# EAGLE design HB-UNI-SEN-CAP-MOIST (EAGLE 9.3.1)
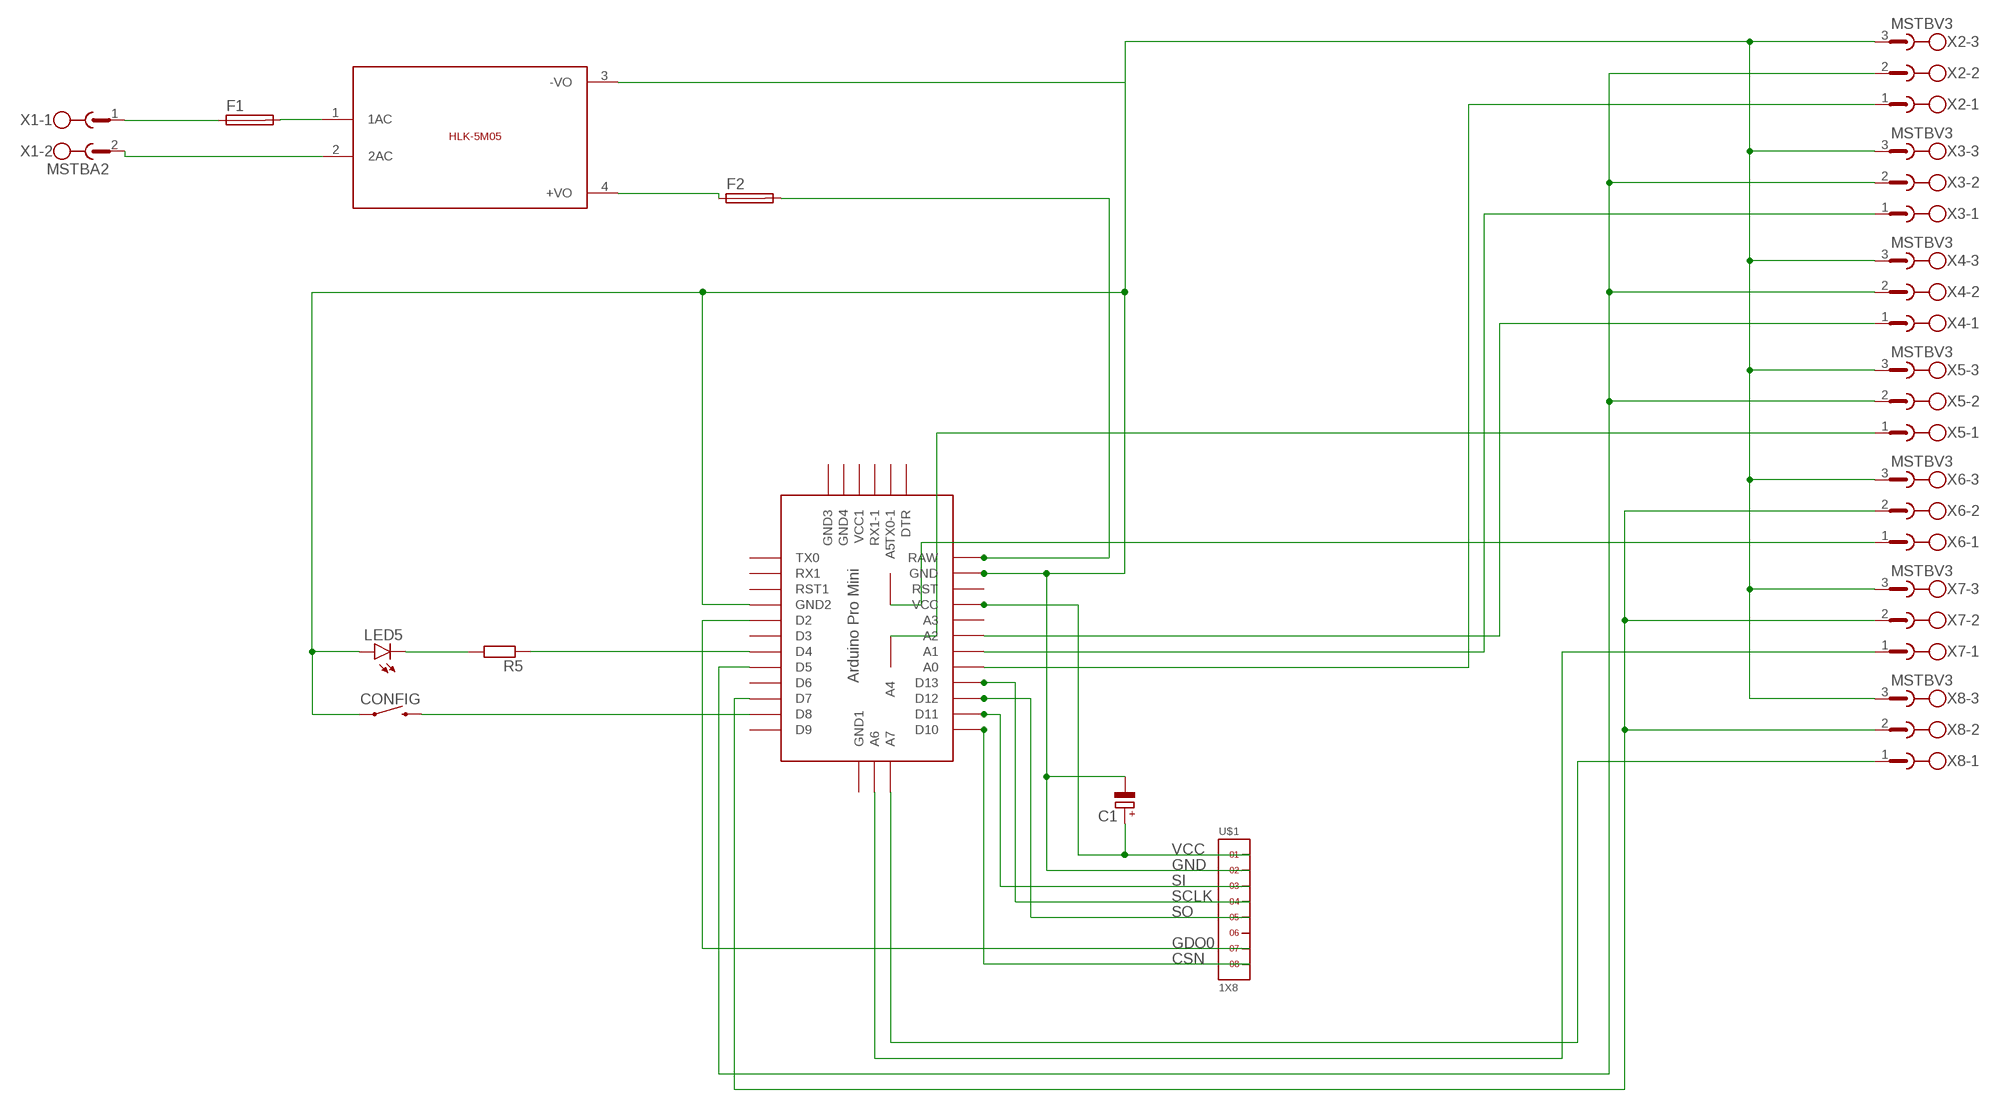
[diagram p0: schematic, sheet 1]

## Parts
C1  CPOL-EUE2.5-5  [E2,5-5]
CONFIG  MOMENTARY-SWITCH-SPST-PTH-6.0MM-KIT  [TACTILE_SWITCH_PTH_6.0MM_KIT]
F1  SH22,5A  [SH22,5A]
F2  SH22,5A  [SH22,5A]
LED5  LED3MM  [LED3MM]
R5  R-EU_0309/10  [0309/10]
U$1  1X8  [1X8]
U$2  ABK-PRO-MINI  [ABK-PRO-MINI]
U$3  5VDC/5W  HLK-5M05  [HLK-5M05]
X1  MSTBA2  [MSTBA2]
X2  MSTBV3  [MSTBV3]
X3  MSTBV3  [MSTBV3]
X4  MSTBV3  [MSTBV3]
X5  MSTBV3  [MSTBV3]
X6  MSTBV3  [MSTBV3]
X7  MSTBV3  [MSTBV3]
X8  MSTBV3  [MSTBV3]

## Nets
CSN: U$1.8 U$2.D10
GDO0: U$1.7 U$2.D2
GND: C1.- CONFIG.1 LED5.A U$1.2 U$2.GND U$2.GND1(GND2) U$3.3(-VO) X2.3 X3.3 X4.3 X5.3 X6.3 X7.3 X8.3
N$1: U$2.A0 X2.1
N$2: U$2.A1 X3.1
N$3: U$2.A2 X4.1
N$4: U$2.A4 X5.1
N$5: U$2.A5 X6.1
N$6: U$2.A6 X7.1
N$7: U$2.A7 X8.1
N$8: U$2.D5 X2.2 X3.2 X4.2 X5.2
N$9: F1.1 X1.1
N$10: F2.1 U$3.4(+VO)
N$11: U$3.2(2AC) X1.2
N$12: U$2.D7 X6.2 X7.2 X8.2
N$16: CONFIG.3 U$2.D8
N$17: R5.1 U$2.D4
N$18: LED5.K(C) R5.2
N$19: F1.2 U$3.1(1AC)
N$24: F2.2 U$2.RAW
SCLK: U$1.4 U$2.D13
SI: U$1.3 U$2.D11
SO: U$1.5 U$2.D12
VCC: C1.+ U$1.1 U$2.VCC
Unconnected: U$1.6 U$2.A3 U$2.D3 U$2.D6 U$2.D9 U$2.DTR U$2.GND2(GND3) U$2.GND3(GND4) U$2.GND4(GND1) U$2.RST U$2.RST1 U$2.RX1 U$2.RX1-1 U$2.TX0 U$2.TX0-1 U$2.VCC1

## Library data of the parts
C1 = resistor:CPOL-EU: POLARIZED CAPACITOR, European symbol
CONFIG = SparkFun-Switches:MOMENTARY-SWITCH-SPST: Momentary Switch (Pushbutton) - SPST Normally-open (NO) SPST momentary switches (buttons, pushbuttons). Variants PTH-12MM - 12mm square, through-hole Momentary Pushbutton Switch - 12mm Square <https://www.sparkfun.com/products/9190> (COM-09190) PTH-6.0MM, PTH-6.0MM-KIT - 6.0mm square, through-hole Mini Pushbutton Switch <https://www.sparkfun.com/products/97> (COM-00097) KIT package intended for soldering kit's - only one side of pads' copper is exposed. PTH-RIGHT-ANGLE-KIT - Right-angle, through-hole Right Angle Tactile Button <https://www.sparkfun.com/products/10791> - Used on SparkFun BigTime Watch Kit <https://www.sparkfun.com/products/11734> SMD-12MM - 12mm square, surface-mount Tactile Button - SMD (12mm) <https://www.sparkfun.com/products/12993> (COM-12993) Used on SparkFun PicoBoard <https://www.sparkfun.com/products/11888> SMD-4.5MM - 4.5mm Square Trackball Switch Used on SparkFun Blackberry Trackballer Breakout <https://www.sparkfun.com/products/13169> SMD-4.6MMX2.8MM - 4.60mm x 2.80mm, surface mount Used on SparkFun SAMD21 Mini Breakout <https://www.sparkfun.com/products/13664> SMD-5.2MM, SMD-5.2-REDUNDANT - 5.2mm square, surface-mount Mini Pushbutton Switch - SMD <https://www.sparkfun.com/products/8720> (COM-08720) Used on Arduino Pro Mini <https://www.sparkfun.com/products/11114> REDUNDANT package connects both switch circuits together SMD-6.0X3.5MM - 6.0 x 3.5mm, surface mount Momentary Reset Switch SMD <https://www.sparkfun.com/products/8229> (COM-08229) SMD-6.2MM-TALL - 6.2mm square, surface mount Tactile Button - SMD (6mm) <https://www.sparkfun.com/products/12992> Used on SparkFun Digital Sandbox <https://www.sparkfun.com/products/12651> SMD-RIGHT-ANGLE - Right-angle, surface mount Used on SparkFun Block for Intel® Edison - Arduino <https://www.sparkfun.com/products/13036>; PROD_ID: SWCH-08441; SF_SKU: COM-00097
F1 F2 = fuse:SH22,5A: FUSE HOLDER grid 22,5mm, isolated cap OGN0031 8201, Schurter (Buerklin); MPN: 0031.7701.11; OC_FARNELL: unknown; OC_NEWARK: 04F1224
LED5 = led:LED: LED OSRAM: - CHIPLED LG R971, LG N971, LY N971, LG Q971, LY Q971, LO R971, LY R971 LH N974, LH R974 LS Q976, LO Q976, LY Q976 LO Q996 - Hyper CHIPLED LW Q18S LB Q993, LB Q99A, LB R99A - SideLED LS A670, LO A670, LY A670, LG A670, LP A670 LB A673, LV A673, LT A673, LW A673 LH A674 LY A675 LS A676, LA A676, LO A676, LY A676, LW A676 LS A679, LY A679, LG A679 - Hyper Micro SIDELED® LS Y876, LA Y876, LO Y876, LY Y876 LT Y87S - SmartLED LW L88C, LW L88S LB L89C, LB L89S, LG L890 LS L89K, LO L89K, LY L89K LS L896, LA L896, LO L896, LY L896 - TOPLED LS T670, LO T670, LY T670, LG T670, LP T670 LSG T670, LSP T670, LSY T670, LOP T670, LYG T670 LG T671, LOG T671, LSG T671 LB T673, LV T673, LT T673, LW T673 LH T674 LS T676, LA T676, LO T676, LY T676, LB T676, LH T676, LSB T676, LW T676 LB T67C, LV T67C, LT T67C, LS T67K, LO T67K, LY T67K, LW E67C LS E67B, LA E67B, LO E67B, LY E67B, LB E67C, LV E67C, LT E67C LW T67C LS T679, LY T679, LG T679 LS T770, LO T770, LY T770, LG T770, LP T770 LB T773, LV T773, LT T773, LW T773 LH T774 LS E675, LA E675, LY E675, LS T675 LS T776, LA T776, LO T776, LY T776, LB T776 LHGB T686 LT T68C, LB T68C - Hyper Mini TOPLED® LB M676 - Mini TOPLED Santana® LG M470 LS M47K, LO M47K, LY M47K Source: http://www.osram.convergy.de LUXEON: - LUMILED® LXK2-PW12-R00, LXK2-PW12-S00, LXK2-PW14-U00, LXK2-PW14-V00 LXK2-PM12-R00, LXK2-PM12-S00, LXK2-PM14-U00 LXK2-PE12-Q00, LXK2-PE12-R00, LXK2-PE12-S00, LXK2-PE14-T00, LXK2-PE14-U00 LXK2-PB12-K00, LXK2-PB12-L00, LXK2-PB12-M00, LXK2-PB14-N00, LXK2-PB14-P00, LXK2-PB14-Q00 LXK2-PR12-L00, LXK2-PR12-M00, LXK2-PR14-Q00, LXK2-PR14-R00 LXK2-PD12-Q00, LXK2-PD12-R00, LXK2-PD12-S00 LXK2-PH12-R00, LXK2-PH12-S00 LXK2-PL12-P00, LXK2-PL12-Q00, LXK2-PL12-R00 Source: www.luxeon.com KINGBRIGHT: KA-3528ASYC Source: www.kingbright.com
R5 = resistor:R-EU_: RESISTOR, European symbol
U$1 = headers(2mm):1X8
U$2 = Arduino-clone:ABK-PRO-MINI: ABK Pro-Mini Arduino Clone
U$3 = HLK-5M05:HLK-5M05: HLK-5M05 is an 5Volt/5W smps developed by HI-LINK; SIZE: 23x38(mm)
X1 = con-phoenix-508:MSTBA2: PHOENIX; MF: FARNELL; MPN: 1757242; OC_FARNELL: 3705171; OC_NEWARK: 71C4161
X2-X8 = con-phoenix-508:MSTBV3: PHOENIX; MPN: MSTBV 2,5/3-GF-5.08; OC_FARNELL: 1792793; OC_NEWARK: 69R9846

## Board
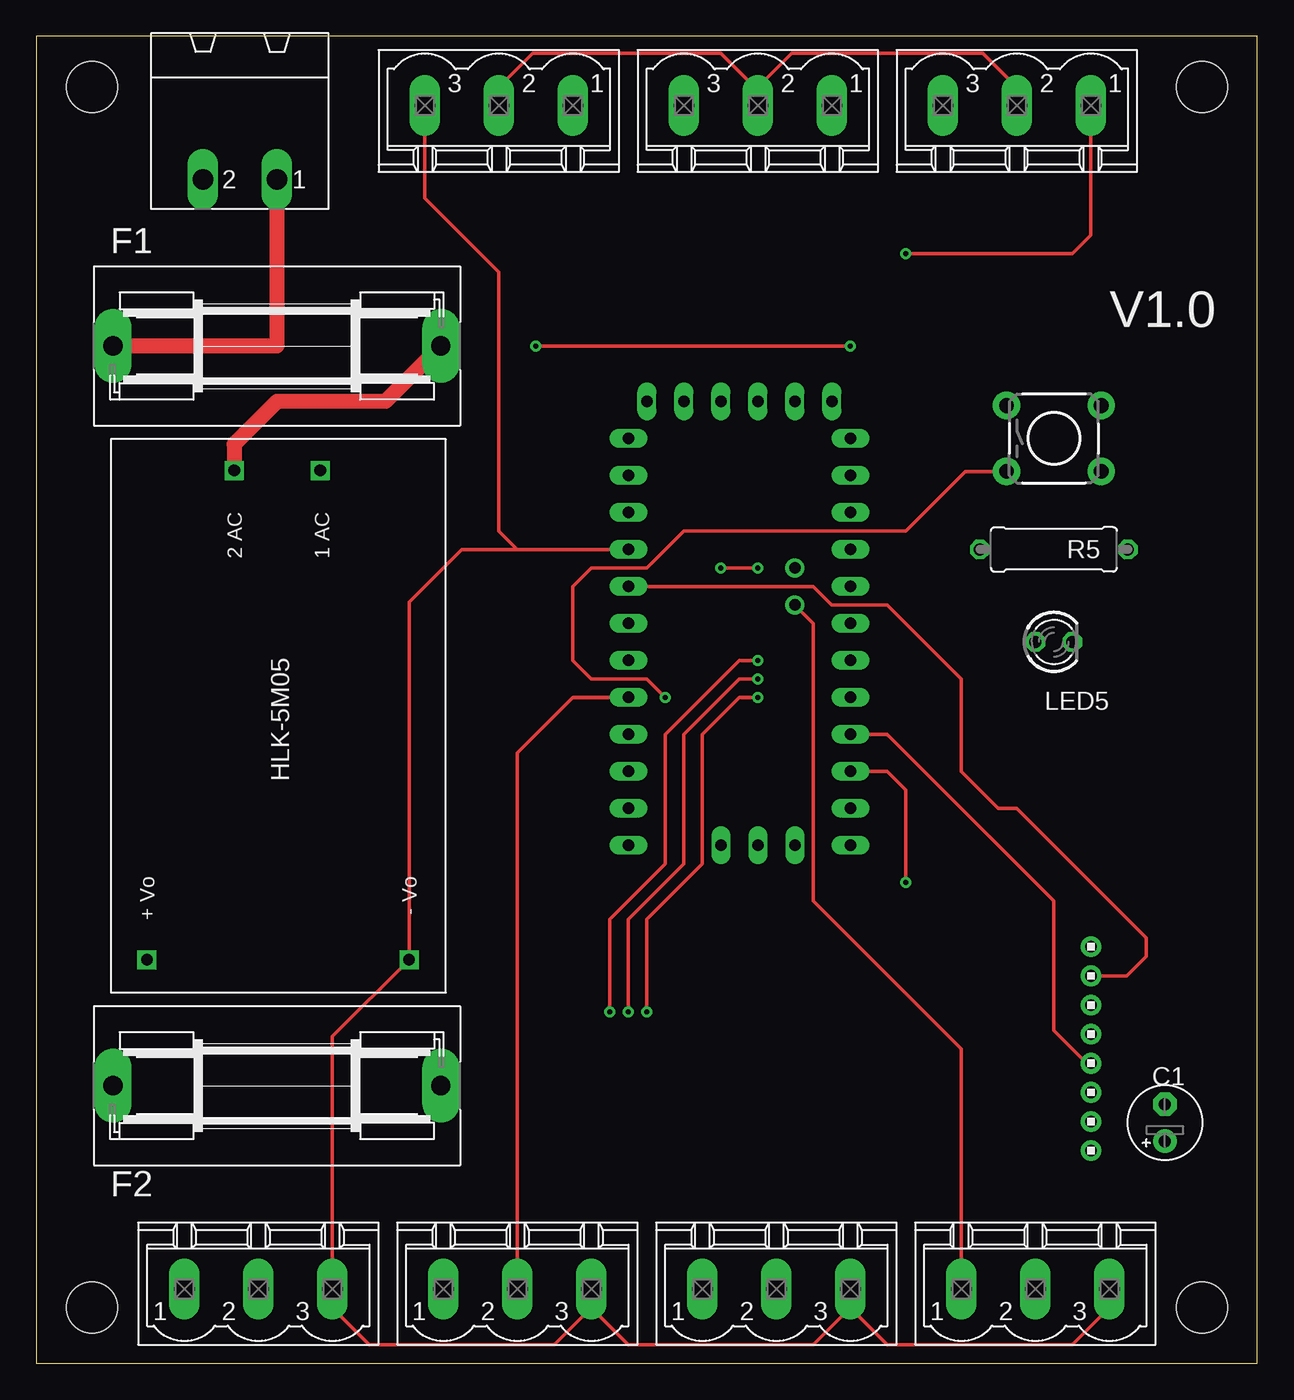
[diagram p1: board, top side]
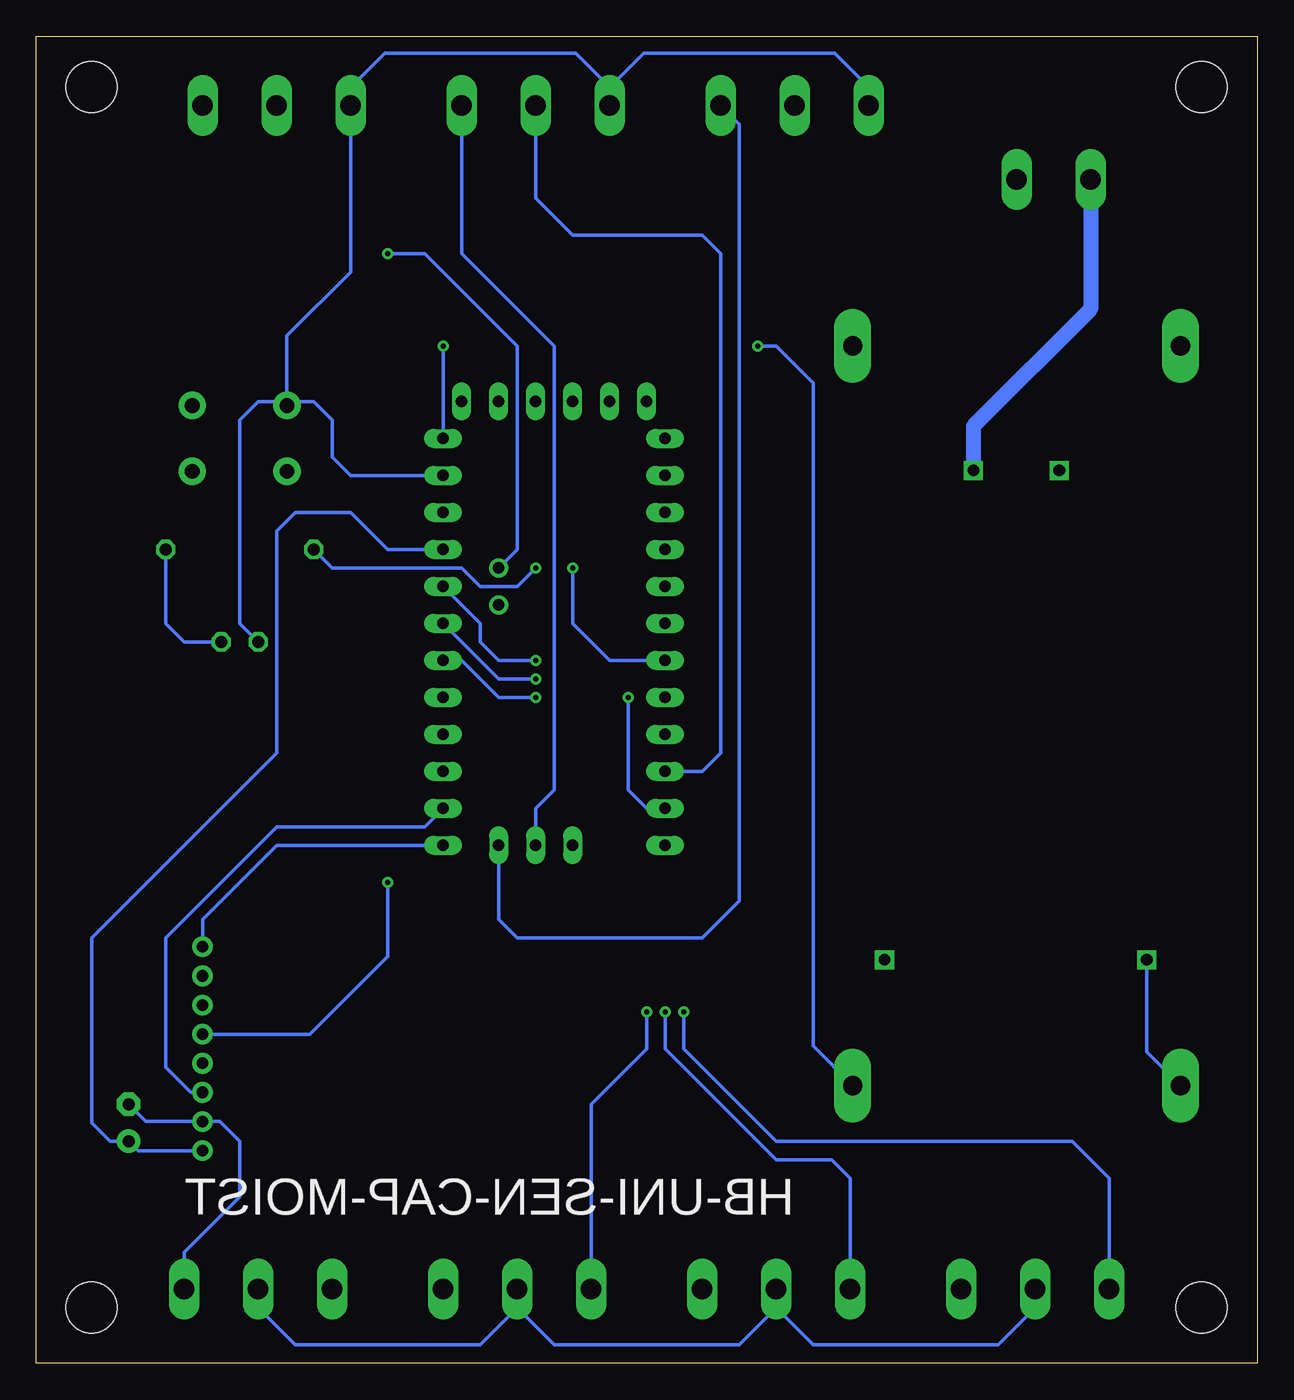
[diagram p2: board, bottom side, seen from below]

Size 83.8 x 91.11 mm. Coordinates in mm from the lower left corner, seen from the top.
Outline: 0,0 83.8,0 83.8,91.11 0,91.11 0,0
Copper layers (1*16): Top 0.035mm / dielectric 1.5mm / Bottom 0.035mm
Design rules "default": minimum track width 6mil, minimum drill 0.35mm, track to track 6mil, track to pad 6mil, pad to pad 6mil, via to via 6mil, smd to smd 6mil, copper to edge 40mil, drill to drill 6mil, minimum pad ring 10mil, minimum via ring 8mil, stop-mask expansion 4mil, vias tented up to drill 0mil, thermal gap 10mil
Holes 3.5 mm at 3.81,3.81 80.01,3.81 3.81,87.63 80.01,87.63

### Footprints (pad centres in the part's own frame; a part is rotated, then mirrored left to right if it is on the bottom)
E2,5-5 = drill 0.813 pad 1.6: + -1.27,0 | drill 0.813 pad 1.6 octagon: - 1.27,0
TACTILE_SWITCH_PTH_6.0MM_KIT = drill 1.016 pad 1.88: 1 -3.251,2.261; 2 3.251,2.261; 3 -3.251,-2.261; 4 3.251,-2.261
SH22,5A = drill 1.321 pad 2.54 long: 1 -11.252,0; 2 11.252,0
LED3MM = drill 0.813 octagon: A -1.27,0; K 1.27,0
0309/10 = drill 0.813 octagon: 1 -5.08,0; 2 5.08,0
1X8 = drill 0.8 pad 1.422: 1 -7,0; 2 -5,0; 3 -3,0; 4 -1,0; 5 1,0; 6 3,0; 7 5,0; 8 7,0
ABK-PRO-MINI = drill 0.8 long: A0 10.16,-3.81; A1 10.16,-6.35; A2 10.16,-8.89; A3 10.16,-11.43; A6 3.81,-21.59; A7 6.35,-21.59; D2 -5.08,-3.81; D3 -5.08,-6.35; D4 -5.08,-8.89; D5 -5.08,-11.43; D6 -5.08,-13.97; D7 -5.08,-16.51; D8 -5.08,-19.05; D9 -5.08,-21.59; D10 10.16,-21.59; D11 10.16,-19.05; D12 10.16,-16.51; D13 10.16,-13.97; DTR 8.89,8.89; GND 10.16,3.81; GND1 -5.08,-1.27; GND2 -3.81,8.89; GND3 -1.27,8.89; GND4 1.27,-21.59; RAW 10.16,6.35; RST 10.16,1.27; RST1 -5.08,1.27; RX1 -5.08,3.81; RX1-1 3.81,8.89; TX0 -5.08,6.35; TX0-1 6.35,8.89; VCC 10.16,-1.27; VCC1 1.27,8.89 | drill 0.8: A4 6.35,-5.08; A5 6.35,-2.54
HLK-5M05 = drill 0.8 square: 1 -16.85,-2.93; 2 -16.85,2.97; 3 16.75,9.07; 4 16.75,-8.93
MSTBA2 = drill 1.397 long: 1 -2.54,5.08; 2 2.54,5.08
MSTBV3 = drill 1.397 long: 1 -5.08,0; 2 0,0; 3 5.08,0

### Placement (x,y rotation side)
C1  77.47,16.51 90 top
CONFIG  69.85,63.5 0 top
F1  16.51,69.85 0 top
F2  16.51,19.05 0 top
LED5  69.85,49.53 0 top
R5  69.85,55.88 0 top
U$1  72.39,21.59 90 top
U$2  45.72,57.15 0 top
U$3  16.51,44.45 270 top
X1  13.97,86.36 180 top
X2  15.24,5.08 0 top
X3  33.02,5.08 0 top
X4  50.8,5.08 0 top
X5  68.58,5.08 0 top
X6  67.31,86.36 180 top
X7  49.53,86.36 180 top
X8  31.75,86.36 180 top

### Tracks (layer width: path | path; a pad name or v marks a point on that pad's centre or on a via)
CSN
  Bottom 0.254: U$2.D10 67.31,35.56 72.39,30.48 U$1.8
GDO0
  Top 0.254: U$2.D2 53.34,53.34 54.61,52.07 58.42,52.07 63.5,46.99 63.5,40.64 66.04,38.1 67.31,38.1 76.2,29.21 76.2,27.94 74.85,26.59 U$1.7
GND
  Top 0.254: 38.1,3.81 35.56,1.27 22.86,1.27 20.32,3.81 X2.3 20.32,22.44 U$3.3 25.58,52.25 29.21,55.88 U$2.GND1 33.02,55.88 31.75,57.15 31.75,74.93 26.67,80.01 X8.3 | X3.3 38.1,3.81 | 38.1,3.81 40.64,1.27 53.34,1.27 55.88,3.81 | 55.88,3.81 X4.3 | X5.3 73.66,3.81 71.12,1.27 58.42,1.27 55.88,3.81
  Bottom 0.254: C1.- 76.28,16.59 U$1.2 71.2,16.59 69.85,15.24 69.85,11.43 73.66,7.62 X5.3 | X8.3 26.67,87.63 29.01,89.97 42.11,89.97 44.45,87.63 | X7.3 44.45,87.63 | 44.45,87.63 46.79,89.97 59.89,89.97 62.23,87.63 X6.3 62.23,74.93 66.6,70.56 66.6,66.04 | 66.6,66.04 CONFIG.1 | U$2.GND 62.23,60.96 63.5,62.23 63.5,64.77 64.77,66.04 66.6,66.04 | LED5.A 69.85,50.8 69.85,64.77 68.58,66.04 66.6,66.04
N$1  (via drill 0.35)
  Top 0.254: v39.37,24.13 39.37,30.48 43.18,34.29 43.18,43.18 48.26,48.26 v49.53,48.26
  Bottom 0.254: X2.1 10.16,12.7 12.7,15.24 33.02,15.24 39.37,21.59 v39.37,24.13 | v49.53,48.26 52.07,48.26 53.34,49.53 53.34,50.8 U$2.A0
N$2  (via drill 0.35)
  Top 0.254: v40.64,24.13 40.64,30.48 44.45,34.29 44.45,43.18 48.26,46.99 v49.53,46.99
  Bottom 0.254: X3.1 27.94,12.7 29.21,13.97 33.02,13.97 40.64,21.59 v40.64,24.13 | v49.53,46.99 52.07,46.99 U$2.A1
N$3  (via drill 0.35)
  Top 0.254: v41.91,24.13 41.91,30.48 45.72,34.29 45.72,43.18 48.26,45.72 v49.53,45.72
  Bottom 0.254: X4.1 45.72,17.78 41.91,21.59 v41.91,24.13 | v49.53,45.72 52.07,45.72 54.61,48.26 U$2.A2
N$4
  Top 0.254: U$2.A4 53.34,50.8 53.34,31.75 63.5,21.59 X5.1
N$5  (via drill 0.35)
  Top 0.254: v59.69,76.2 71.12,76.2 72.39,77.47 X6.1
  Bottom 0.254: U$2.A5 50.8,55.88 50.8,69.85 57.15,76.2 v59.69,76.2
N$6
  Bottom 0.254: X7.1 54.61,76.2 48.26,69.85 48.26,39.37 49.53,38.1 U$2.A6
N$7
  Bottom 0.254: X8.1 35.56,85.09 35.56,31.75 38.1,29.21 50.8,29.21 52.07,30.48 U$2.A7
N$8
  Top 0.254: U$2.D5 36.83,45.72 33.02,41.91 X3.2
  Bottom 0.254: X2.2 15.24,3.81 17.78,1.27 30.48,1.27 33.02,3.81 | X3.2 33.02,3.81 | 33.02,3.81 35.56,1.27 48.26,1.27 50.8,3.81 | X4.2 50.8,3.81 | 50.8,3.81 53.34,1.27 66.04,1.27 68.58,3.81 X5.2
N$9
  Top 1.016: X1.1 16.51,69.85 F1.1
N$10
  Bottom 0.254: U$3.4 7.58,21.37 F2.1
N$11
  Bottom 1.016: X1.2 11.43,72.39 19.48,64.34 U$3.2
N$12
  Top 0.254: X8.2 31.75,87.63 34.09,89.97 46.99,89.97 49.33,87.63 49.53,87.63 | 49.53,87.63 X7.2 | X6.2 67.31,87.63 64.97,89.97 51.87,89.97 49.53,87.63
  Bottom 0.254: X7.2 49.53,80.01 46.99,77.47 38.1,77.47 36.83,76.2 36.83,41.91 38.1,40.64 U$2.D7
N$16  (via drill 0.35)
  Top 0.254: CONFIG.3 63.78,61.24 59.69,57.15 44.45,57.15 41.91,54.61 38.1,54.61 36.83,53.34 36.83,48.26 38.1,46.99 41.91,46.99 v43.18,45.72
  Bottom 0.254: v43.18,45.72 43.18,39.37 41.91,38.1 U$2.D8
N$17  (via drill 0.35)
  Top 0.254: v49.53,54.61 v46.99,54.61
  Bottom 0.254: R5.1 63.5,54.61 54.61,54.61 53.34,53.34 50.8,53.34 v49.53,54.61 | v46.99,54.61 46.99,50.8 44.45,48.26 U$2.D4
N$18
  Bottom 0.254: LED5.K 73.66,49.53 74.93,50.8 R5.2
N$19
  Top 1.016: F1.2 23.95,66.04 16.51,66.04 13.58,63.11 U$3.1
N$24  (via drill 0.35)
  Top 0.254: v34.29,69.85 v55.88,69.85
  Bottom 0.254: F2.2 30.48,21.77 30.48,67.31 33.02,69.85 v34.29,69.85 | v55.88,69.85 U$2.RAW
SCLK
  Top 0.254: U$2.D13 58.42,43.18 69.85,31.75 69.85,22.86 72.12,20.59 U$1.4
SI
  Bottom 0.254: U$2.D11 57.15,36.83 67.31,36.83 74.93,29.21 74.93,20.32 73.2,18.59 U$1.3
SO  (via drill 0.35)
  Top 0.254: v59.69,33.02 59.69,39.37 58.42,40.64 U$2.D12
  Bottom 0.254: U$1.5 65.04,22.59 59.69,27.94 v59.69,33.02
VCC
  Bottom 0.254: U$1.1 76.82,14.59 C1.+ 78.74,15.24 80.01,16.51 80.01,29.21 67.31,41.91 67.31,57.15 66.04,58.42 62.23,58.42 59.69,55.88 U$2.VCC

### Text on the board
tNames: V1.0
bNames: HB-UNI-SEN-CAP-MOIST